# EAGLE design SensorBoardR1a (EAGLE 7.6.0)
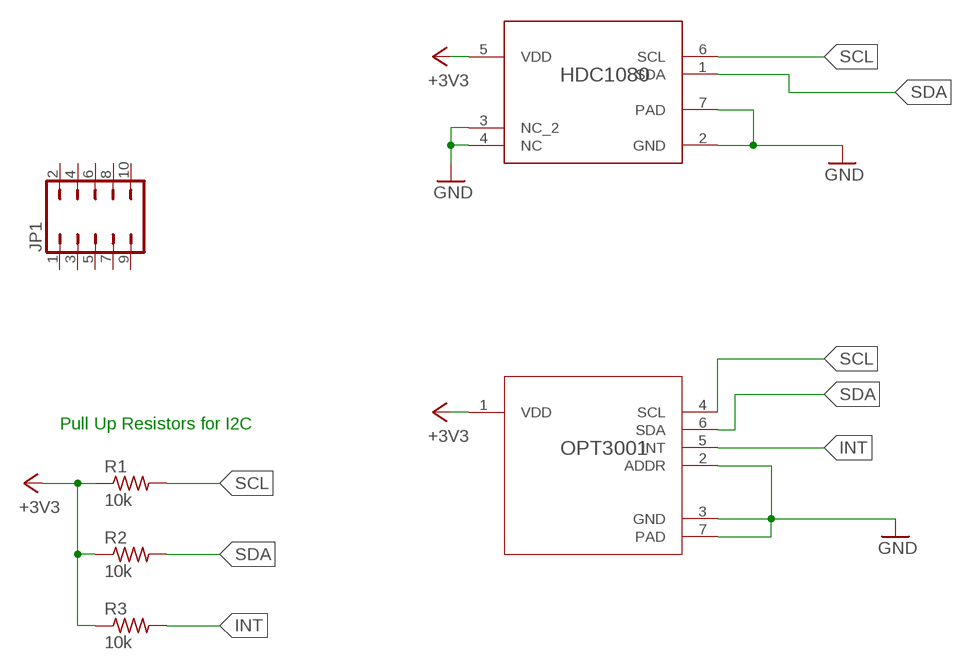
[diagram p0: schematic, sheet 1]

## Parts
HDC1080  HDC1080DMBR  [DMB0006A]
JP1  JP5Q  [JP5Q]
OPT3001  OPT3001DNPR  [DNP0006A]
R1  10k  R-US_R0805  [R0805]
R2  10k  R-US_R0805  [R0805]
R3  10k  R-US_R0805  [R0805]

## Nets
+3V3: HDC1080.5(VDD) OPT3001.1(VDD) R1.1 R2.1 R3.1
GND: HDC1080.2(GND) HDC1080.3(NC_2) HDC1080.4(NC) HDC1080.7(PAD) OPT3001.2(ADDR) OPT3001.3(GND) OPT3001.7(PAD)
INT: OPT3001.5(INT) R3.2
SCL: HDC1080.6(SCL) OPT3001.4(SCL) R1.2
SDA: HDC1080.1(SDA) OPT3001.6(SDA) R2.2
Unconnected: JP1.1 JP1.2 JP1.3 JP1.4 JP1.5 JP1.6 JP1.7 JP1.8 JP1.9 JP1.10

## Notes on the sheet
- Pull Up Resistors for I2C

## Library data of the parts
HDC1080 = HDC1080:HDC1080DMBR; ALTERNATEPARTNUMBER: HDC1080DMBT; APPLICATION_BUILDNUMBER: *; COMPTYPE: IC; MANUFACTURER: Texas Instruments; MOUNTTYPE: SMT; PACKAGEREFERENCE: DMB0006A; PARTNUMBER: HDC1080DMBR; PIN_COUNT: 7; REFDES: RefDes; TYPE: TYPE; VALUE: Value
JP1 = jumper:JP5Q: JUMPER
OPT3001 = OPT3001:OPT3001DNPR; APPLICATION_BUILDNUMBER: *; COMPTYPE: IC; MANUFACTURER: Texas Instruments; MOUNTTYPE: SMT; PACKAGEREFERENCE: DNP0006A; PARTNUMBER: OPT3001DNP; PIN_COUNT: 7; REFDES: RefDes; ROHS: Y; TYPE: TYPE; VALUE: Value
R1-R3 = rcl:R-US_: RESISTOR, American symbol

## Board
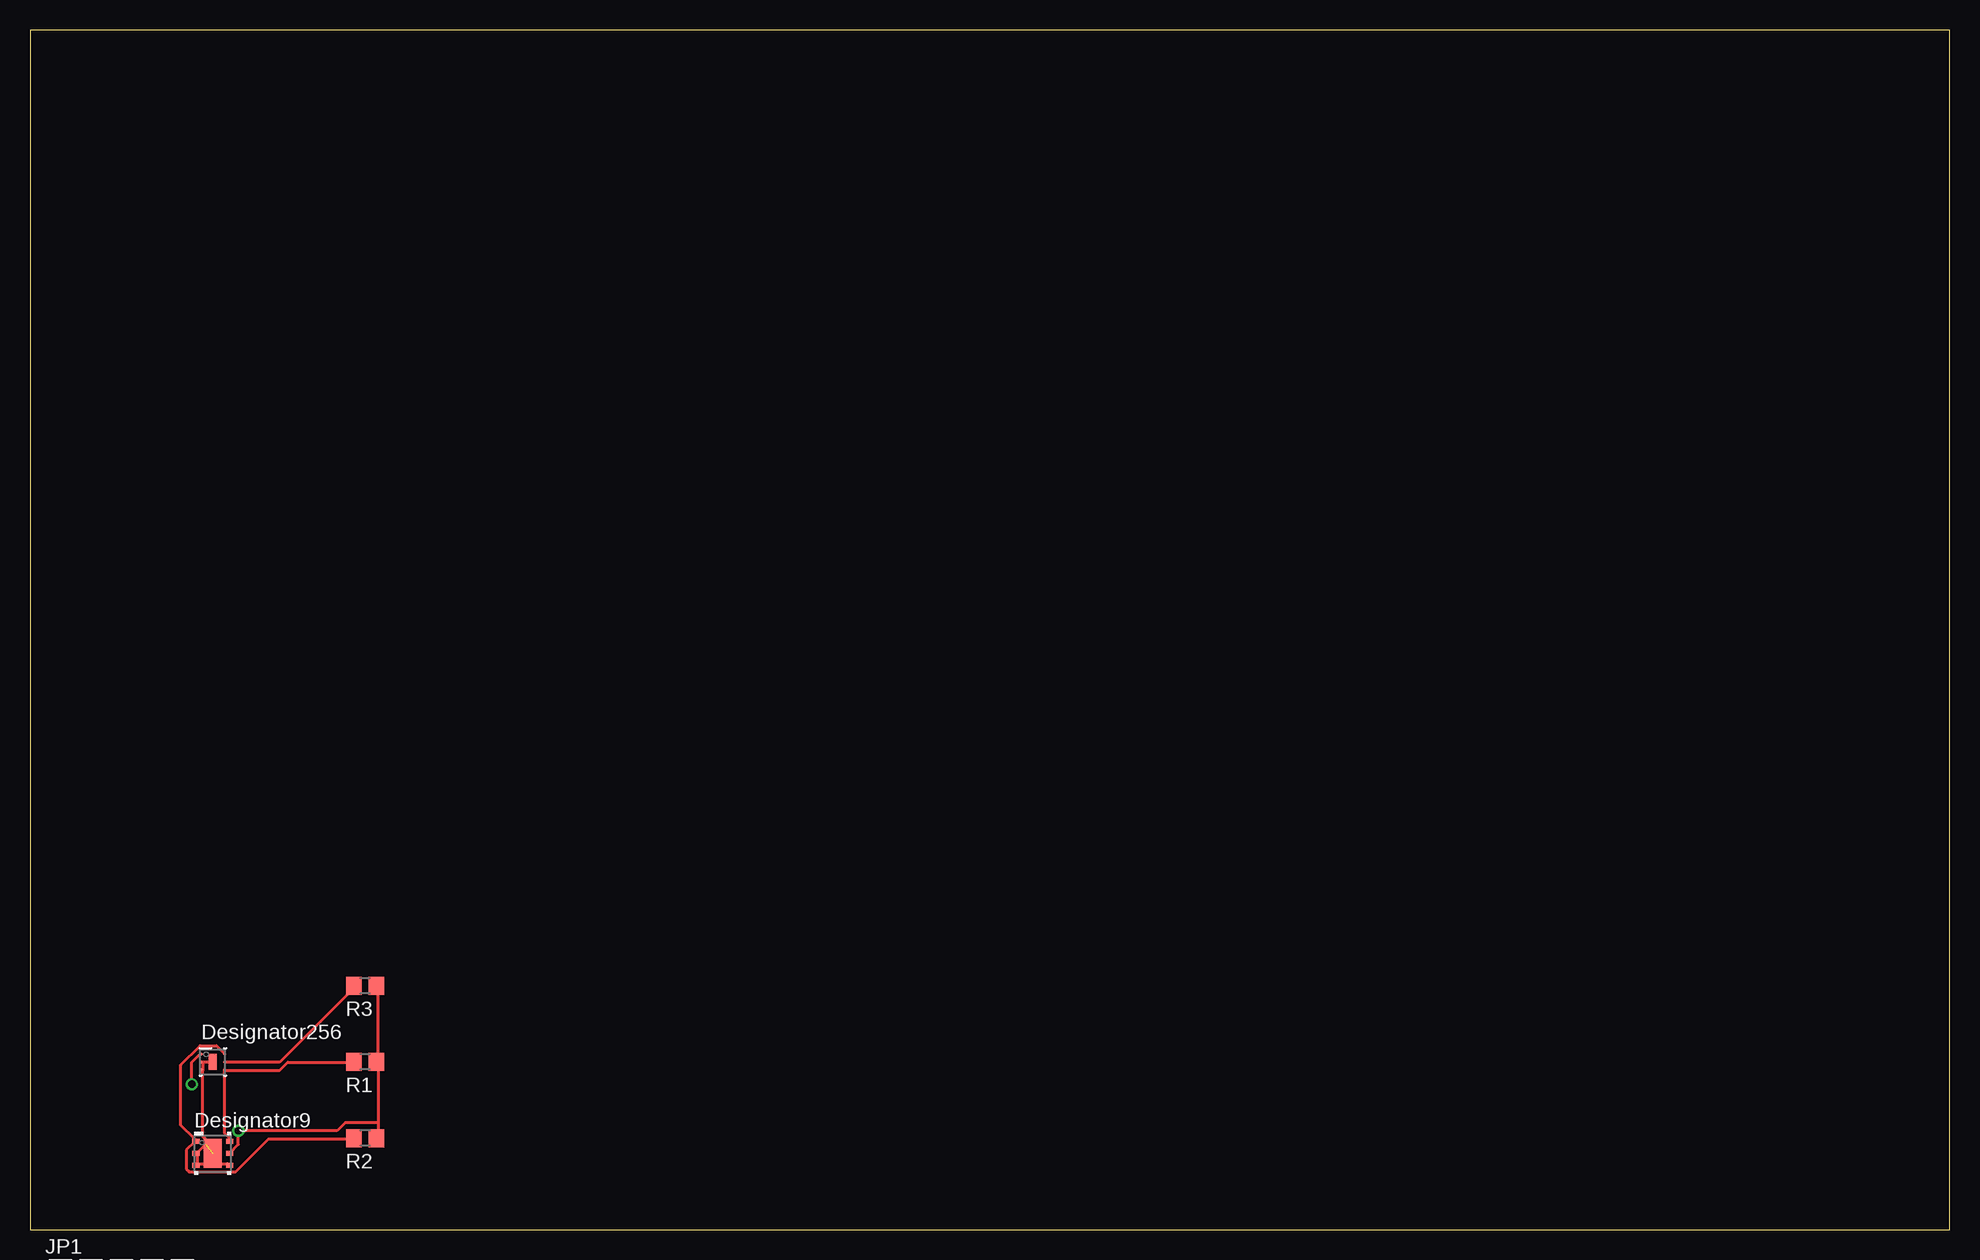
[diagram p1: board, top side]
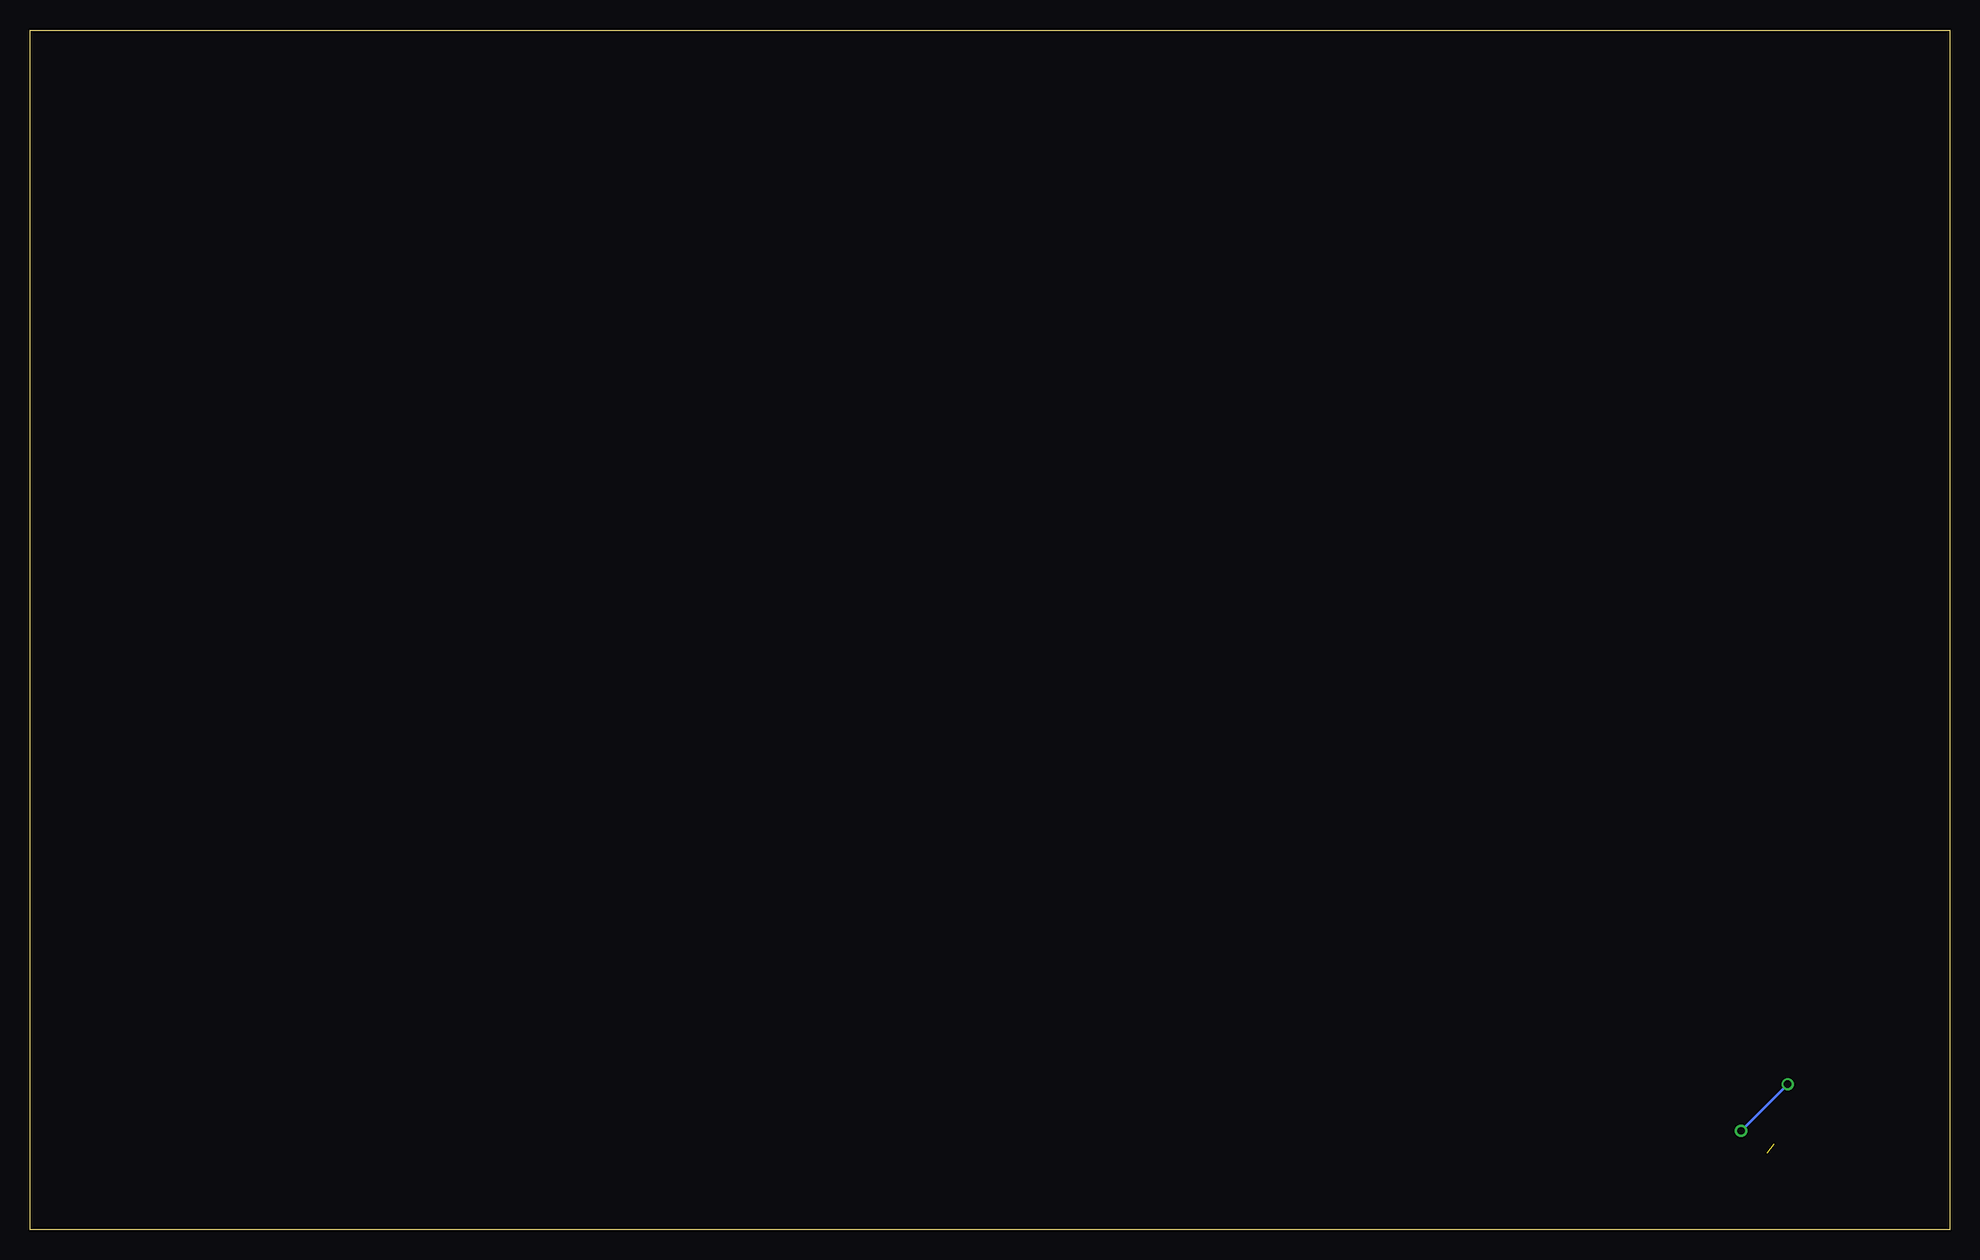
[diagram p2: board, bottom side, seen from below]

Size 160 x 100 mm. Coordinates in mm from the lower left corner, seen from the top.
Outline: 0,0 160,0 160,100 0,100 0,0
Copper layers (1*16): Top 0.035mm / dielectric 1.5mm / Bottom 0.035mm
Design rules "default": minimum track width 10mil, minimum drill 24mil, track to track 8mil, track to pad 8mil, pad to pad 8mil, via to via 8mil, smd to smd 8mil, copper to edge 40mil, drill to drill 8mil, minimum pad ring 10mil, minimum via ring 8mil, stop-mask expansion 4mil, vias tented up to drill 0mil, thermal gap 10mil

### Footprints (pad centres in the part's own frame; a part is rotated, then mirrored left to right if it is on the bottom)
DMB0006A = smd 0.6 x 0.4: 1 -1.4,1; 2 -1.4,0; 3 -1.4,-1; 4 1.4,-1; 5 1.4,0; 6 1.4,1 | smd 1.5 x 2.4: 7 0,0 | smd 0.5 x 0.5: V -0.5,0
JP5Q = drill 0.914 octagon: 1 -5.08,-1.27; 2 -5.08,1.27; 3 -2.54,-1.27; 4 -2.54,1.27; 5 0,-1.27; 6 0,1.27; 7 2.54,-1.27; 8 2.54,1.27; 9 5.08,-1.27; 10 5.08,1.27
DNP0006A = smd 0.25 x 0.25: 1 -0.95,0.65; 2 -0.95,0; 3 -0.95,-0.655; 4 0.95,-0.65; 5 0.95,0; 6 0.95,0.65 | smd 0.65 x 1.35: 7 0,0
R0805 = smd 1.3 x 1.5: 1 -0.95,0; 2 0.95,0

### Placement (x,y rotation side)
HDC1080  15.24,6.35 0 top
JP1  7.62,-5.08 0 top  (outside the outline)
OPT3001  15.24,13.97 0 top
R1  27.94,13.97 180 top
R2  27.94,7.62 180 top
R3  27.94,20.32 180 top

### Tracks (layer width: path | path; a pad name or v marks a point on that pad's centre or on a via)
+3V3  (via drill 0.61)
  Top 0.254: v13.49,12.12 13.49,13.95 14.17,14.63 OPT3001.1 | HDC1080.5 16.69,6.4 17.37,7.09 v17.37,8.23 25.6,8.23 26.29,8.91 29.03,8.91 | 29.03,8.91 29.03,13.95 R1.1 29.03,14.17 29.03,20.12 R3.1 | 29.03,8.91 29.03,7.77 R2.1
  Bottom 0.254: v17.37,8.23 v13.49,12.12
GND  (1 unrouted)
  Top 0.254: 14.4,13.95 14.4,13.26 | 14.4,13.95 15.09,13.95 OPT3001.7 | 14.4,13.95 OPT3001.2 | 13.95,5.49 13.95,6.17 HDC1080.2 13.95,6.4 14.63,7.09 14.63,7.54 14.4,7.77 14.4,13.26 | 13.95,5.49 16.46,5.49 HDC1080.4 | 13.95,5.49 HDC1080.3 | 14.4,13.26 OPT3001.3
INT
  Top 0.254: OPT3001.5 16.23,13.95 20.8,13.95 26.98,20.12 R3.2
SCL
  Top 0.254: 16.23,13.26 16.23,8 16.69,7.54 HDC1080.6 | 16.23,13.26 20.8,13.26 21.49,13.95 26.98,13.95 R1.2 | 16.23,13.26 OPT3001.4
SDA
  Top 0.254: OPT3001.6 16.23,14.63 15.54,15.32 14.17,15.32 12.57,13.72 12.57,8.69 13.72,7.54 HDC1080.1 13.72,7.32 13.03,6.63 13.03,5.03 13.26,4.8 17.14,4.8 19.89,7.54 26.98,7.54 R2.2